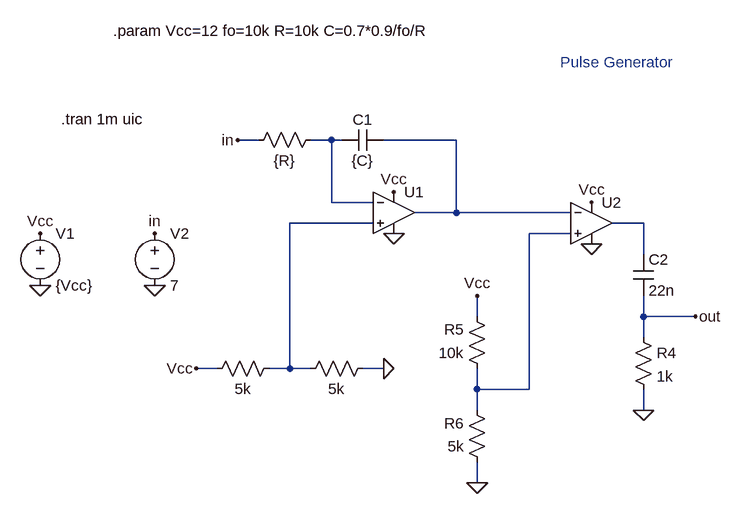
[diagram p0: schematic PulseGenerator.asc]
PulseGenerator.asc, the LTspice schematic file:
Version 4
SHEET 1 1000 680
WIRE 272 -32 240 -32
WIRE 384 -32 352 -32
WIRE 400 -32 384 -32
WIRE 576 -32 464 -32
WIRE 384 64 384 -32
WIRE 448 64 384 64
WIRE 576 80 576 -32
WIRE 576 80 512 80
WIRE 752 80 576 80
WIRE 448 96 320 96
WIRE 864 96 816 96
WIRE 752 112 688 112
WIRE 864 144 864 96
WIRE 608 240 608 208
WIRE 864 240 864 208
WIRE 944 240 864 240
WIRE 864 272 864 240
WIRE 208 320 176 320
WIRE 320 320 320 96
WIRE 320 320 288 320
WIRE 352 320 320 320
WIRE 464 320 432 320
WIRE 608 352 608 320
WIRE 688 352 688 112
WIRE 688 352 608 352
WIRE 608 384 608 352
WIRE 864 384 864 352
WIRE 608 496 608 464
FLAG 176 320 Vcc
FLAG 464 320 0
FLAG 240 -32 in
FLAG -64 112 Vcc
FLAG -64 192 0
FLAG 112 192 0
FLAG 112 112 in
FLAG 480 112 0
FLAG 480 48 Vcc
FLAG 864 384 0
FLAG 608 208 Vcc
FLAG 608 496 0
FLAG 784 64 Vcc
FLAG 784 128 0
FLAG 944 240 out
SYMBOL res 304 304 R90
WINDOW 0 0 56 Invisible 2
WINDOW 3 32 56 VTop 2
SYMATTR InstName R1
SYMATTR Value 5k
SYMBOL res 448 304 R90
WINDOW 0 0 56 Invisible 2
WINDOW 3 32 56 VTop 2
SYMATTR InstName R2
SYMATTR Value 5k
SYMBOL res 368 -48 R90
WINDOW 0 0 56 Invisible 2
WINDOW 3 32 56 VTop 2
SYMATTR InstName R3
SYMATTR Value {R}
SYMBOL cap 400 -16 R270
WINDOW 0 32 32 VTop 2
WINDOW 3 0 32 VBottom 2
SYMATTR InstName C1
SYMATTR Value {C}
SYMBOL voltage -64 96 R0
SYMATTR InstName V1
SYMATTR Value {Vcc}
SYMBOL voltage 112 96 R0
WINDOW 123 0 0 Left 0
WINDOW 39 0 0 Left 0
SYMATTR InstName V2
SYMATTR Value 7
SYMBOL OpAmps\\UniversalOpAmp2 480 80 R0
SYMATTR InstName U1
SYMBOL cap 848 144 R0
SYMATTR InstName C2
SYMATTR Value 22n
SYMBOL res 848 256 R0
SYMATTR InstName R4
SYMATTR Value 1k
SYMBOL OpAmps\\UniversalOpAmp2 784 96 R0
SYMATTR InstName U2
SYMBOL res 624 336 R180
WINDOW 0 36 76 Left 2
WINDOW 3 36 40 Left 2
SYMATTR InstName R5
SYMATTR Value 10k
SYMBOL res 624 480 R180
WINDOW 0 36 76 Left 2
WINDOW 3 36 40 Left 2
SYMATTR InstName R6
SYMATTR Value 5k
TEXT -32 -64 Left 2 !.tran 1m uic
TEXT 736 -152 Left 2 ;Pulse Generator
TEXT 48 -200 Left 2 !.param Vcc=12 fo=10k R=10k C=0.7*0.9/fo/R

The netlist it stands for:
* PulseGenerator.asc
R1 N003 Vcc 5k
R2 0 N003 5k
R3 N001 in {R}
C1 N001 N002 {C}
V1 Vcc 0 {Vcc}
V2 in 0 7
XU1 N003 N001 Vcc 0 N002 level2 Avol=1Meg GBW=10Meg Slew=10Meg Ilimit=25m Rail=0 Vos=0 En=0 Enk=0 In=0 Ink=0 Rin=500Meg  ; pins In+ In- V+ V- OUT
C2 N004 out 22n
R4 out 0 1k
XU2 N005 N002 Vcc 0 N004 level2 Avol=1Meg GBW=10Meg Slew=10Meg Ilimit=25m Rail=0 Vos=0 En=0 Enk=0 In=0 Ink=0 Rin=500Meg  ; pins In+ In- V+ V- OUT
R5 N005 Vcc 10k
R6 0 N005 5k
.tran 1m uic
* Pulse Generator
.param Vcc=12 fo=10k R=10k C=0.7*0.9/fo/R
.lib UniversalOpAmp2.lib
.backanno
.end